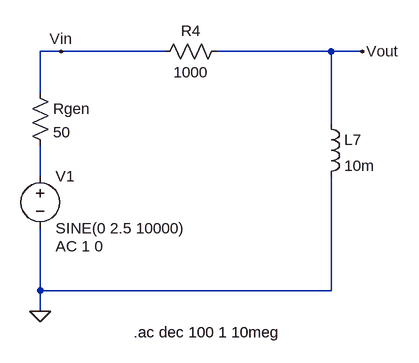
[diagram p0: schematic series_RL_filter.asc]
series_RL_filter.asc, the LTspice schematic file:
Version 4
SHEET 1 880 680
WIRE 144 -64 112 -64
WIRE 304 -64 144 -64
WIRE 560 -64 384 -64
WIRE 608 -64 560 -64
WIRE 112 0 112 -64
WIRE 560 48 560 -64
WIRE 112 128 112 80
WIRE 112 304 112 208
WIRE 560 304 560 128
WIRE 560 304 112 304
WIRE 112 336 112 304
FLAG 112 336 0
FLAG 608 -64 Vout
FLAG 144 -64 Vin
SYMBOL voltage 112 112 R0
WINDOW 123 24 124 Left 2
WINDOW 39 0 0 Left 0
SYMATTR InstName V1
SYMATTR Value SINE(0 2.5 10000)
SYMATTR Value2 AC 1 0
SYMBOL res 96 -16 R0
SYMATTR InstName Rgen
SYMATTR Value 50
SYMBOL res 400 -80 R90
WINDOW 0 0 56 VBottom 2
WINDOW 3 32 56 VTop 2
SYMATTR InstName R4
SYMATTR Value 1000
SYMBOL ind 544 32 R0
SYMATTR InstName L7
SYMATTR Value 10m
TEXT 256 368 Left 2 !.ac dec 100 1 10meg

The netlist it stands for:
* series_RL_filter.asc
V1 N001 0 SINE(0 2.5 10000) AC 1 0
Rgen Vin N001 50
R4 Vout Vin 1000
L7 Vout 0 10m
.ac dec 100 1 10meg
.backanno
.end